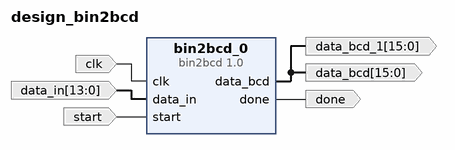
[diagram p0: block diagram of the top level]
# Vivado block design design_bin2bcd, xc7z020clg400-2, Vivado 2019.1
create_bd_design design_bin2bcd

create_bd_port -dir O -from 15 -to 0 data_bcd
create_bd_port -dir O -from 15 -to 0 data_bcd_1
create_bd_port -dir I -type clk clk
create_bd_port -dir I -from 13 -to 0 data_in
create_bd_port -dir O done
create_bd_port -dir I start

create_bd_cell -type ip -vlnv xilinx.com:user:bin2bcd:1.0 bin2bcd_0

# ---- connections ----

connect_bd_net [get_bd_pins bin2bcd_0/data_bcd] [get_bd_ports data_bcd] [get_bd_ports data_bcd_1]
connect_bd_net -net clk_0_1 [get_bd_ports clk] [get_bd_pins bin2bcd_0/clk]
connect_bd_net -net data_in_0_1 [get_bd_ports data_in] [get_bd_pins bin2bcd_0/data_in]
connect_bd_net [get_bd_pins bin2bcd_0/done] [get_bd_ports done]
connect_bd_net -net start_0_1 [get_bd_ports start] [get_bd_pins bin2bcd_0/start]

validate_bd_design
save_bd_design
